# EAGLE schematic hb100_smd (EAGLE 6.1)
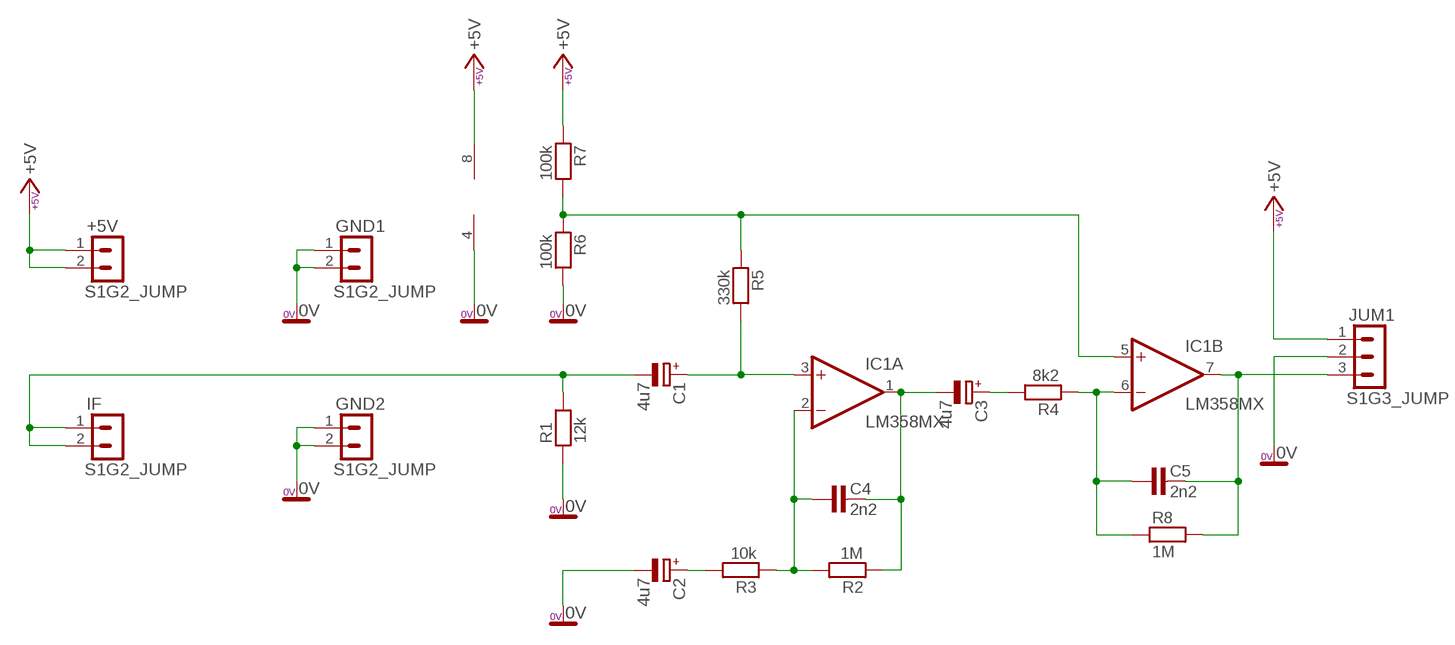
[diagram p0: schematic, sheet 1]

## Parts
+5V  S1G2_JUMP  [S1G2_JUM]
C1  4u7  CPOL-EUSMCA  [SMC_A]
C2  4u7  CPOL-EUSMCA  [SMC_A]
C3  4u7  CPOL-EUSMCA  [SMC_A]
C4  2n2  C-KERAMIK_SMD_0805  [0805]
C5  2n2  C-KERAMIK_SMD_0805  [0805]
GND1  S1G2_JUMP  [S1G2_JUM]
GND2  S1G2_JUMP  [S1G2_JUM]
IC1  LM358MX  [SO08]
IF  S1G2_JUMP  [S1G2_JUM]
JUM1  S1G3_JUMP  [S1G3_JUM]
R1  12k  R_SMD_0805  [0805]
R2  1M  R_SMD_0805  [0805]
R3  10k  R_SMD_0805  [0805]
R4  8k2  R_SMD_0805  [0805]
R5  330k  R_SMD_0805  [0805]
R6  100k  R_SMD_0805  [0805]
R7  100k  R_SMD_0805  [0805]
R8  1M  R_SMD_0805  [0805]

## Nets
0V: C2.- GND1.1 GND1.2 GND2.1 GND2.2 IC1.4(P:V-) JUM1.2 R1.1 R6.2
+5V: +5V.1 +5V.2 IC1.8(P:V+) JUM1.1 R7.1
N$1: C1.- IF.1 IF.2 R1.2
N$2: C1.+ IC1.3(A:+IN) R5.2
N$3: C3.+ R4.2
N$4: IC1.5(B:+IN) R5.1 R6.1 R7.2
N$5: C3.- C4.2 IC1.1(A:OUT) R2.1
N$6: C5.1 IC1.6(B:-IN) R4.1 R8.1
N$8: C2.+ R3.2
N$9: C4.1 IC1.2(A:-IN) R2.2 R3.1
N$10: C5.2 IC1.7(B:OUT) JUM1.3 R8.2

## Library data of the parts
+5V GND1 GND2 IF = #PaJa_konektory:S1G2_JUMP: Radove konektory - koliky - 2x
C1-C3 = rcl:CPOL-EU: POLARIZED CAPACITOR, European symbol
C4 C5 = #PaJa_30:C-KERAMIK: Kondenzator - keramicky
IC1 = linear:LM358: OP AMP also LM158; LM258; LM2904 Source: http://cache.national.com/ds/LM/LM158.pdf
JUM1 = #PaJa_konektory:S1G3_JUMP: Radove konektory - koliky - 3x
R1-R8 = #PaJa_30:R: Rezistor